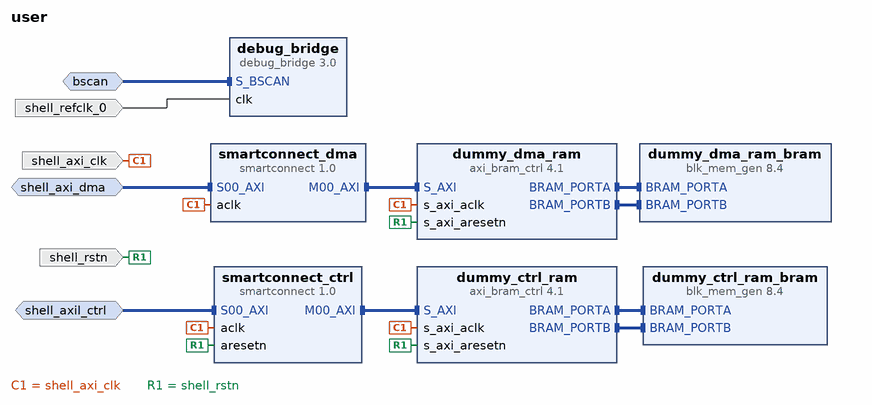
[diagram p0: block diagram of the top level]
# Vivado block design user, xc7a200tfbg484-2, Vivado 2022.2
create_bd_design user

create_bd_intf_port -mode Slave -vlnv xilinx.com:interface:bscan_rtl:1.0 bscan
create_bd_intf_port -mode Slave -vlnv xilinx.com:interface:aximm_rtl:1.0 shell_axi_dma
set_property -dict [list \
  CONFIG.ADDR_WIDTH 64 \
  CONFIG.ARUSER_WIDTH 0 \
  CONFIG.AWUSER_WIDTH 0 \
  CONFIG.BUSER_WIDTH 0 \
  CONFIG.DATA_WIDTH 128 \
  CONFIG.FREQ_HZ 125000000 \
  CONFIG.HAS_BRESP 1 \
  CONFIG.HAS_BURST 1 \
  CONFIG.HAS_CACHE 1 \
  CONFIG.HAS_LOCK 1 \
  CONFIG.HAS_PROT 1 \
  CONFIG.HAS_QOS 1 \
  CONFIG.HAS_REGION 0 \
  CONFIG.HAS_RRESP 1 \
  CONFIG.HAS_WSTRB 1 \
  CONFIG.ID_WIDTH 0 \
  CONFIG.MAX_BURST_LENGTH 256 \
  CONFIG.NUM_READ_OUTSTANDING 32 \
  CONFIG.NUM_READ_THREADS 1 \
  CONFIG.NUM_WRITE_OUTSTANDING 16 \
  CONFIG.NUM_WRITE_THREADS 1 \
  CONFIG.PROTOCOL AXI4 \
  CONFIG.READ_WRITE_MODE READ_WRITE \
  CONFIG.RUSER_BITS_PER_BYTE 0 \
  CONFIG.RUSER_WIDTH 0 \
  CONFIG.SUPPORTS_NARROW_BURST 0 \
  CONFIG.WUSER_BITS_PER_BYTE 0 \
  CONFIG.WUSER_WIDTH 0 \
  CONFIG.master_id 1 \
] [get_bd_intf_ports shell_axi_dma]
create_bd_intf_port -mode Slave -vlnv xilinx.com:interface:aximm_rtl:1.0 shell_axil_ctrl
set_property -dict [list \
  CONFIG.ADDR_WIDTH 32 \
  CONFIG.ARUSER_WIDTH 0 \
  CONFIG.AWUSER_WIDTH 0 \
  CONFIG.BUSER_WIDTH 0 \
  CONFIG.DATA_WIDTH 32 \
  CONFIG.FREQ_HZ 125000000 \
  CONFIG.HAS_BRESP 1 \
  CONFIG.HAS_BURST 0 \
  CONFIG.HAS_CACHE 0 \
  CONFIG.HAS_LOCK 0 \
  CONFIG.HAS_PROT 1 \
  CONFIG.HAS_QOS 0 \
  CONFIG.HAS_REGION 0 \
  CONFIG.HAS_RRESP 1 \
  CONFIG.HAS_WSTRB 1 \
  CONFIG.ID_WIDTH 0 \
  CONFIG.MAX_BURST_LENGTH 1 \
  CONFIG.NUM_READ_OUTSTANDING 1 \
  CONFIG.NUM_READ_THREADS 1 \
  CONFIG.NUM_WRITE_OUTSTANDING 1 \
  CONFIG.NUM_WRITE_THREADS 1 \
  CONFIG.PROTOCOL AXI4LITE \
  CONFIG.READ_WRITE_MODE READ_WRITE \
  CONFIG.RUSER_BITS_PER_BYTE 0 \
  CONFIG.RUSER_WIDTH 0 \
  CONFIG.SUPPORTS_NARROW_BURST 0 \
  CONFIG.WUSER_BITS_PER_BYTE 0 \
  CONFIG.WUSER_WIDTH 0 \
  CONFIG.master_id 1 \
] [get_bd_intf_ports shell_axil_ctrl]
create_bd_port -dir I -type clk shell_axi_clk
set_property -dict [list \
  CONFIG.ASSOCIATED_BUSIF shell_axi_dma:shell_axil_ctrl \
  CONFIG.ASSOCIATED_RESET shell_rstn \
  CONFIG.FREQ_HZ 125000000 \
] [get_bd_ports shell_axi_clk]
create_bd_port -dir I -type rst shell_rstn
create_bd_port -dir I -type clk shell_refclk_0
set_property -dict {CONFIG.FREQ_HZ 200000000} [get_bd_ports shell_refclk_0]

create_bd_cell -type ip -vlnv xilinx.com:ip:debug_bridge:3.0 debug_bridge
set_property -dict [list \
  CONFIG.C_CLK_INPUT_FREQ_HZ 200000000 \
  CONFIG.C_DESIGN_TYPE 1 \
  CONFIG.C_ENABLE_CLK_DIVIDER true \
  CONFIG.C_NUM_BS_MASTER 0 \
] [get_bd_cells debug_bridge]
create_bd_cell -type ip -vlnv xilinx.com:ip:axi_bram_ctrl:4.1 dummy_ctrl_ram
set_property -dict {CONFIG.PROTOCOL AXI4LITE} [get_bd_cells dummy_ctrl_ram]
create_bd_cell -type ip -vlnv xilinx.com:ip:blk_mem_gen:8.4 dummy_ctrl_ram_bram
set_property -dict {CONFIG.Memory_Type True_Dual_Port_RAM} [get_bd_cells dummy_ctrl_ram_bram]
create_bd_cell -type ip -vlnv xilinx.com:ip:smartconnect:1.0 smartconnect_ctrl
set_property -dict {CONFIG.NUM_SI 1} [get_bd_cells smartconnect_ctrl]
create_bd_cell -type ip -vlnv xilinx.com:ip:smartconnect:1.0 smartconnect_dma
set_property -dict {CONFIG.NUM_SI 1} [get_bd_cells smartconnect_dma]
create_bd_cell -type ip -vlnv xilinx.com:ip:axi_bram_ctrl:4.1 dummy_dma_ram
create_bd_cell -type ip -vlnv xilinx.com:ip:blk_mem_gen:8.4 dummy_dma_ram_bram
set_property -dict {CONFIG.Memory_Type True_Dual_Port_RAM} [get_bd_cells dummy_dma_ram_bram]

# ---- connections ----

connect_bd_intf_net [get_bd_intf_ports bscan] [get_bd_intf_pins debug_bridge/S_BSCAN]
connect_bd_intf_net [get_bd_intf_pins dummy_ctrl_ram_bram/BRAM_PORTA] [get_bd_intf_pins dummy_ctrl_ram/BRAM_PORTA]
connect_bd_intf_net [get_bd_intf_pins dummy_ctrl_ram_bram/BRAM_PORTB] [get_bd_intf_pins dummy_ctrl_ram/BRAM_PORTB]
connect_bd_intf_net [get_bd_intf_pins dummy_dma_ram_bram/BRAM_PORTA] [get_bd_intf_pins dummy_dma_ram/BRAM_PORTA]
connect_bd_intf_net [get_bd_intf_pins dummy_dma_ram_bram/BRAM_PORTB] [get_bd_intf_pins dummy_dma_ram/BRAM_PORTB]
connect_bd_intf_net [get_bd_intf_ports shell_axi_dma] [get_bd_intf_pins smartconnect_dma/S00_AXI]
connect_bd_intf_net [get_bd_intf_ports shell_axil_ctrl] [get_bd_intf_pins smartconnect_ctrl/S00_AXI]
connect_bd_intf_net [get_bd_intf_pins smartconnect_ctrl/M00_AXI] [get_bd_intf_pins dummy_ctrl_ram/S_AXI]
connect_bd_intf_net [get_bd_intf_pins dummy_dma_ram/S_AXI] [get_bd_intf_pins smartconnect_dma/M00_AXI]
connect_bd_net [get_bd_ports shell_axi_clk] \
  [get_bd_pins dummy_ctrl_ram/s_axi_aclk] [get_bd_pins smartconnect_ctrl/aclk] [get_bd_pins dummy_dma_ram/s_axi_aclk] \
  [get_bd_pins smartconnect_dma/aclk]
connect_bd_net [get_bd_ports shell_refclk_0] [get_bd_pins debug_bridge/clk]
connect_bd_net [get_bd_ports shell_rstn] \
  [get_bd_pins dummy_ctrl_ram/s_axi_aresetn] [get_bd_pins smartconnect_ctrl/aresetn] \
  [get_bd_pins dummy_dma_ram/s_axi_aresetn]

# ---- address map ----
assign_bd_address -offset 0x0000000000000000 -range 8K -target_address_space [get_bd_addr_spaces shell_axi_dma] [get_bd_addr_segs dummy_dma_ram/S_AXI/Mem0]
assign_bd_address -offset 0x00000000 -range 8K -target_address_space [get_bd_addr_spaces shell_axil_ctrl] [get_bd_addr_segs dummy_ctrl_ram/S_AXI/Mem0]

validate_bd_design
save_bd_design
